# EAGLE design DAPule-KL26Z-v1.0.0 (EAGLE 7.7.0)

## Sheet 1 of 2
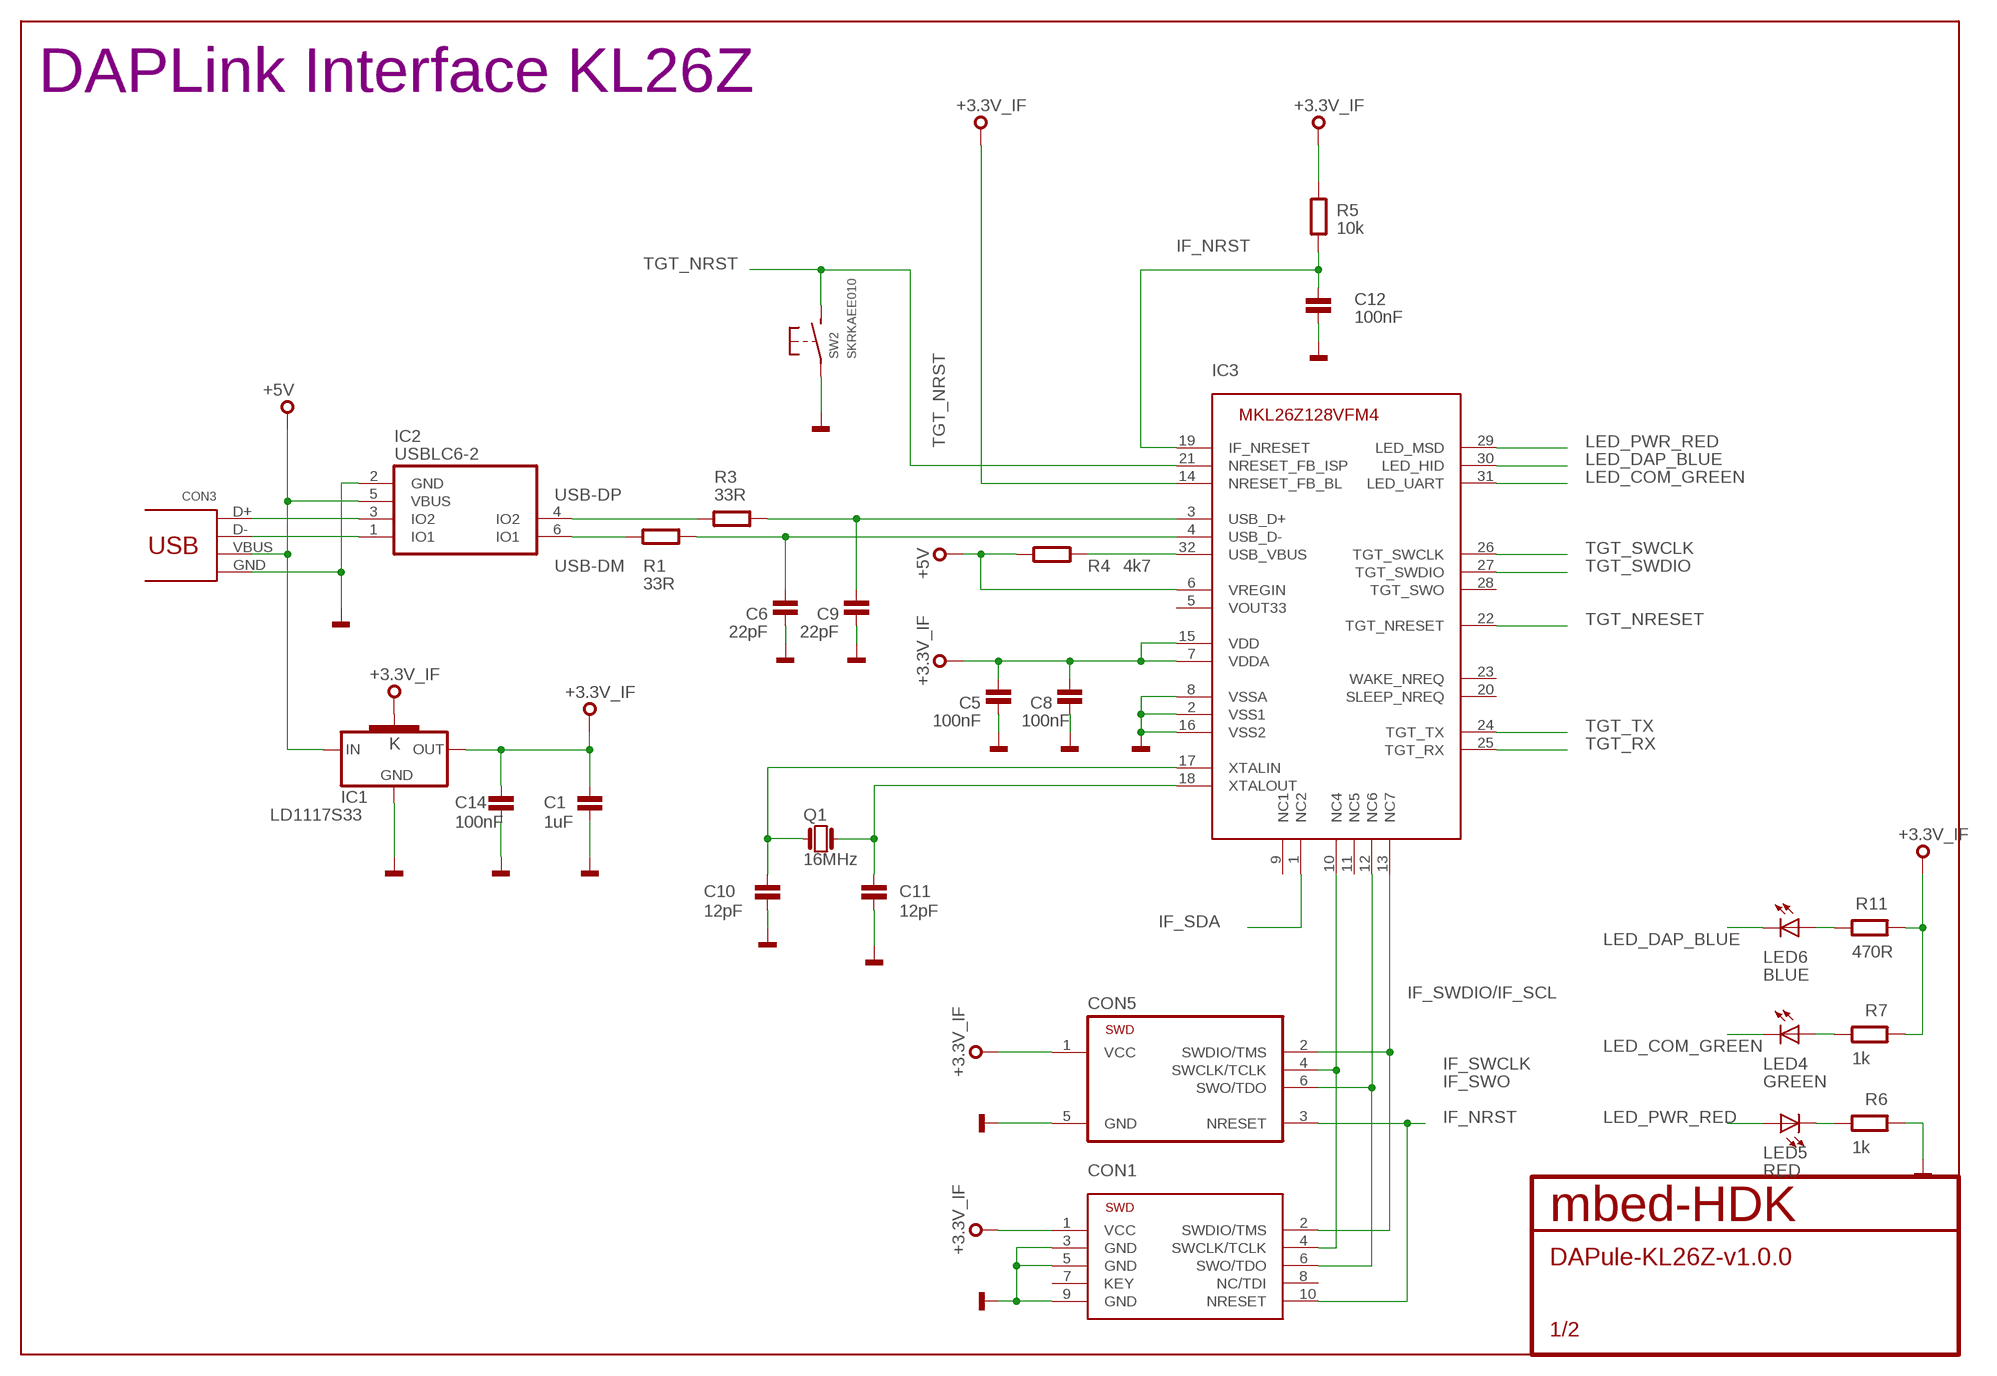
[diagram p0: schematic, sheet 1]

### Parts
C1  1uF  C0603  [0603]
C5  100nF  C0603  [0603]
C6  22pF  C0603  [0603]
C8  100nF  C0603  [0603]
C9  22pF  C0603  [0603]
C10  12pF  C0603  [0603]
C11  12pF  C0603  [0603]
C12  100nF  C0603  [0603]
C14  100nF  C0603  [0603]
CON1  SWD-10-SMD  [SWD-10-SMD]
CON3  USB_MICROB  [MOLEX-47364-0001]
CON5  TC2030-CTX-NL  [TC2030-CTX-NL]
IC1  LD1117S33  [SOT223]
IC2  USBLC6-2SC6  [SOT23-6L]
IC3  IF_MKL26Z128VFM4  [HVQFN32]
LED4  GREEN  LED0603  [CHIPLED_0603]
LED5  RED  LED0603  [CHIPLED_0603]
LED6  BLUE  LED0603  [CHIPLED_0603]
Q1  16MHz  Q_2.5X2.0  [2.5X2.0]
R1  33R  R0603  [0603@1]
R3  33R  R0603  [0603@1]
R4  4k7  R0603  [0603@1]
R5  10k  R0603  [0603@1]
R6  1k  R0603  [0603@1]
R7  1k  R0603  [0603@1]
R11  470R  R0603  [0603@1]
SW2  SKRKAEE010  [SKRKAEE010]

### Nets
+3.3V_IF: C1.1 C5.2 C8.2 C14.1 CON1.1(VCC) CON5.1(VCC) IC1.2(OUT) IC1.4(K) IC3.7(VDDA) IC3.14(NRESET_FB_BL) IC3.15(VDD) R5.2 R7.1 R11.1 ; also sheet 2
+5V: CON3.VBUS IC1.3(IN) IC2.5(VBUS) IC3.6(VREGIN) R4.1
DM: CON3.D- IC2.1(IO1)
DP: CON3.D+ IC2.3(IO2)
GND: C1.2 C5.1 C6.1 C8.1 C9.1 C10.1 C11.1 C12.1 C14.2 CON1.3(GND) CON1.5(GND) CON1.9(GND) CON3.GND CON5.5(GND) IC1.1(GND) IC2.2(GND) IC3.2(VSS1) IC3.8(VSSA) IC3.16(VSS2) R6.1 SW2.P$1(P) ; also sheet 2
IF_NRST: C12.2 CON1.10(NRESET) CON5.3(NRESET) IC3.19(IF_NRESET) R5.1
IF_SDA: IC3.1(NC2) ; also sheet 2
IF_SWCLK: CON1.4(SWCLK/TCLK) CON5.4(SWCLK/TCLK) IC3.10(NC4)
IF_SWDIO/IF_SCL: CON1.2(SWDIO/TMS) CON5.2(SWDIO/TMS) IC3.13(NC7) ; also sheet 2
IF_SWO: CON1.6(SWO/TDO) CON5.6(SWO/TDO) IC3.12(NC6)
LED_COM_GREEN: IC3.31(LED_UART) LED4.C
LED_DAP_BLUE: IC3.30(LED_HID) LED6.C
LED_PWR_RED: IC3.29(LED_MSD) LED5.A
N$2: IC3.32(USB_VBUS) R4.2
N$3: LED6.A R11.2
N$6: LED4.A R7.2
N$7: C6.2 IC3.4(USB_D-) R1.1
N$8: C10.2 IC3.17(XTALIN) Q1.1
N$12: C11.2 IC3.18(XTALOUT) Q1.3
N$16: C9.2 IC3.3(USB_D+) R3.1
N$33: LED5.C R6.2
TGT_NRESET: IC3.22(TGT_NRESET) ; also sheet 2
TGT_NRST: IC3.21(NRESET_FB_ISP) SW2.P$2(S)
TGT_RX: IC3.25(TGT_RX) ; also sheet 2
TGT_SWCLK: IC3.26(TGT_SWCLK) ; also sheet 2
TGT_SWDIO: IC3.27(TGT_SWDIO) ; also sheet 2
TGT_TX: IC3.24(TGT_TX) ; also sheet 2
USB-DM: IC2.6(IO1) R1.2
USB-DP: IC2.4(IO2) R3.2
Unconnected: CON1.7(KEY) CON1.8(NC/TDI) IC3.5(VOUT33) IC3.9(NC1) IC3.11(NC5) IC3.20(SLEEP_NREQ) IC3.23(WAKE_NREQ) IC3.28(TGT_SWO)

### Notes on the sheet
- DAPLink Interface KL26Z

## Sheet 2 of 2
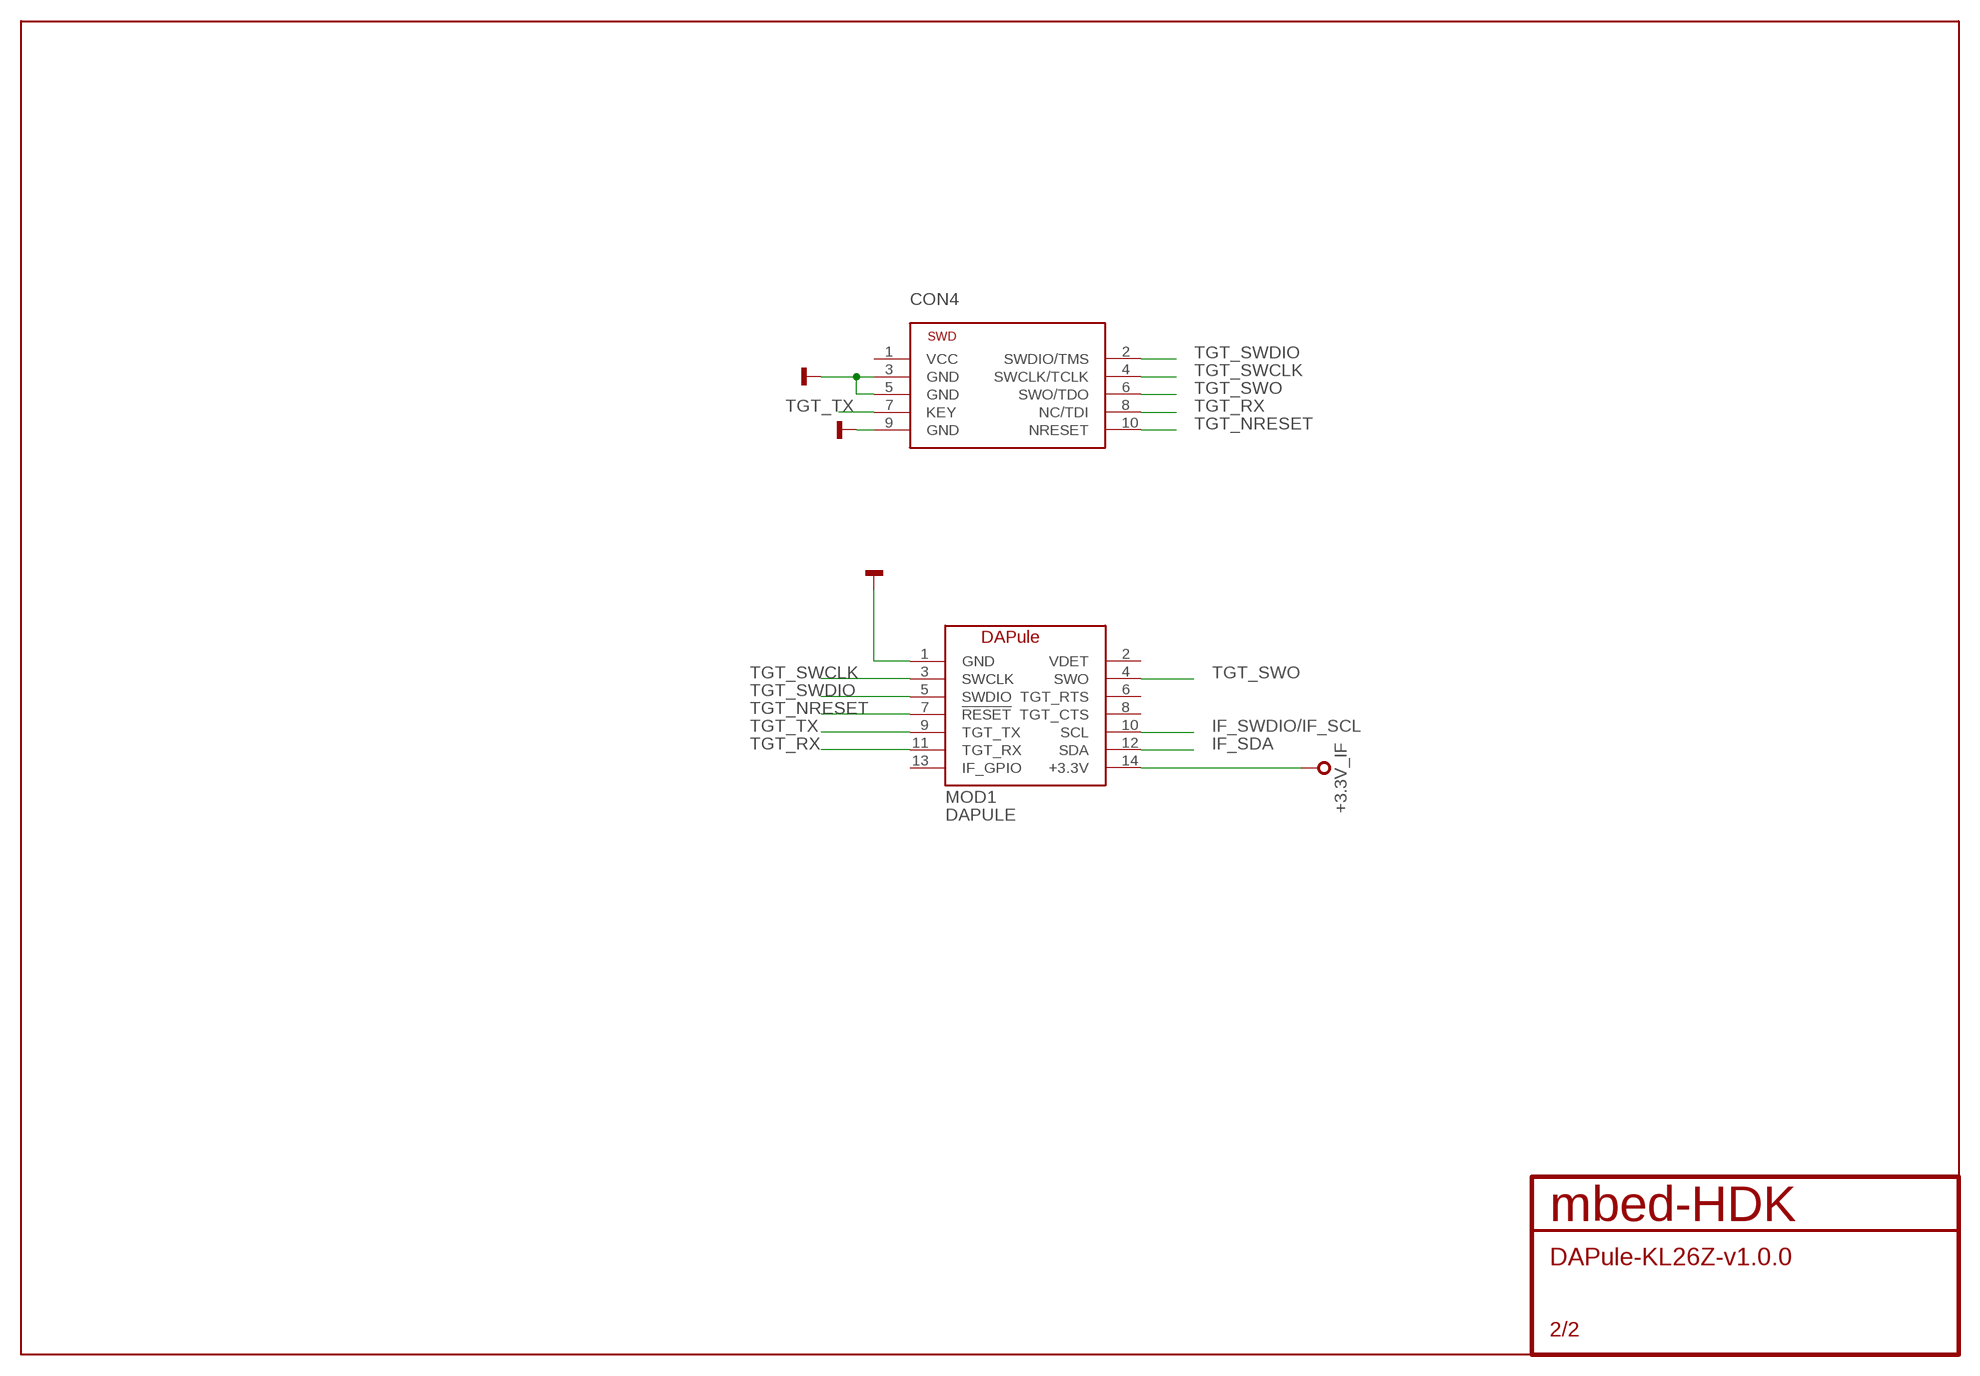
[diagram p1: schematic, sheet 2]

### Parts
CON4  SWD-10-SMD  [SWD-10-SMD]
MOD1  DAPULE  [DAPULE]

### Nets
+3.3V_IF: MOD1.14(+3.3V) ; also sheet 1
GND: CON4.3(GND) CON4.5(GND) CON4.9(GND) MOD1.1(GND) ; also sheet 1
IF_SDA: MOD1.12(SDA) ; also sheet 1
IF_SWDIO/IF_SCL: MOD1.10(SCL) ; also sheet 1
TGT_NRESET: CON4.10(NRESET) MOD1.7(!RESET) ; also sheet 1
TGT_RX: CON4.8(NC/TDI) MOD1.11(TGT_RX) ; also sheet 1
TGT_SWCLK: CON4.4(SWCLK/TCLK) MOD1.3(SWCLK) ; also sheet 1
TGT_SWDIO: CON4.2(SWDIO/TMS) MOD1.5(SWDIO) ; also sheet 1
TGT_SWO: CON4.6(SWO/TDO) MOD1.4(SWO)
TGT_TX: CON4.7(KEY) MOD1.9(TGT_TX) ; also sheet 1
Unconnected: CON4.1(VCC) MOD1.2(VDET) MOD1.6(TGT_RTS) MOD1.8(TGT_CTS) MOD1.13(IF_GPIO)

## Library data of the parts
C1 C5 C6 C8-C12 C14 = mbed-HDK:C: Capacitor
CON1 CON4 = mbed-HDK-Connector:SWD-10: 2.54mm pitch 10-Pin Cortex Programming Header
CON3 = mbed-HDK:USB: USB Connectors
CON5 = mbed-HDK-Connector:TC2030-CTX: Tag-Connect In Circuit Programming & Debug Cable 6 Pin
IC1 = mbed-HDK:LD1117S33: VOLTAGE REGULATOR SMD 3,3V
IC2 = mbed-HDK:USBLC6-2
IC3 = mbed-HDK:IF_MKL26Z128VFM4: CMSIS-DAP Interface (MK20DX128)
LED4-LED6 = mbed-HDK:LED: SMD LED
MOD1 = mbed-HDK-misc-Board:DAPULE
Q1 = mbed-HDK:Q
R1 R3-R7 R11 = mbed-HDK:R
SW2 = mbed-HDK-Switch:SKRKAEE010: MOMENTARY SWITCH PUSH VERTICAL (SPST); MF: ALPS; MFN: SKRKAEE010; OC-MOUSER: 688-SKRKAE

## Board
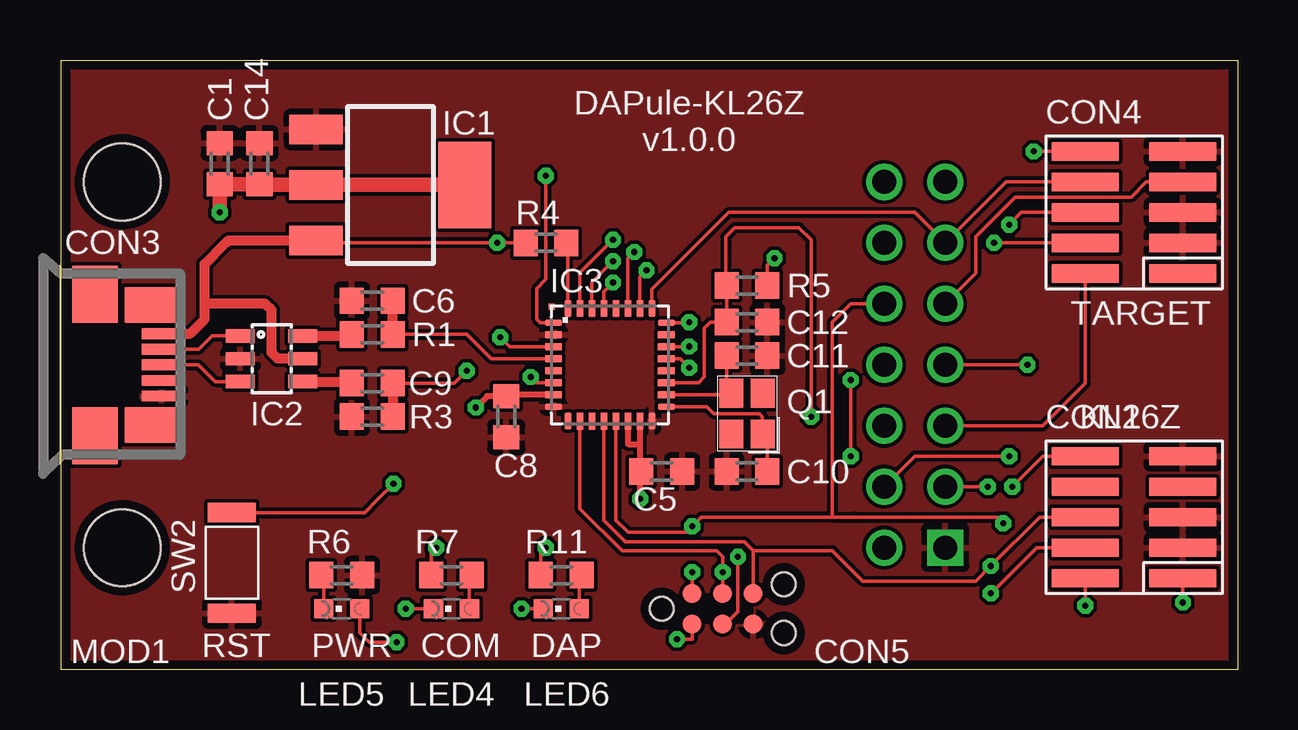
[diagram p2: board, top side]
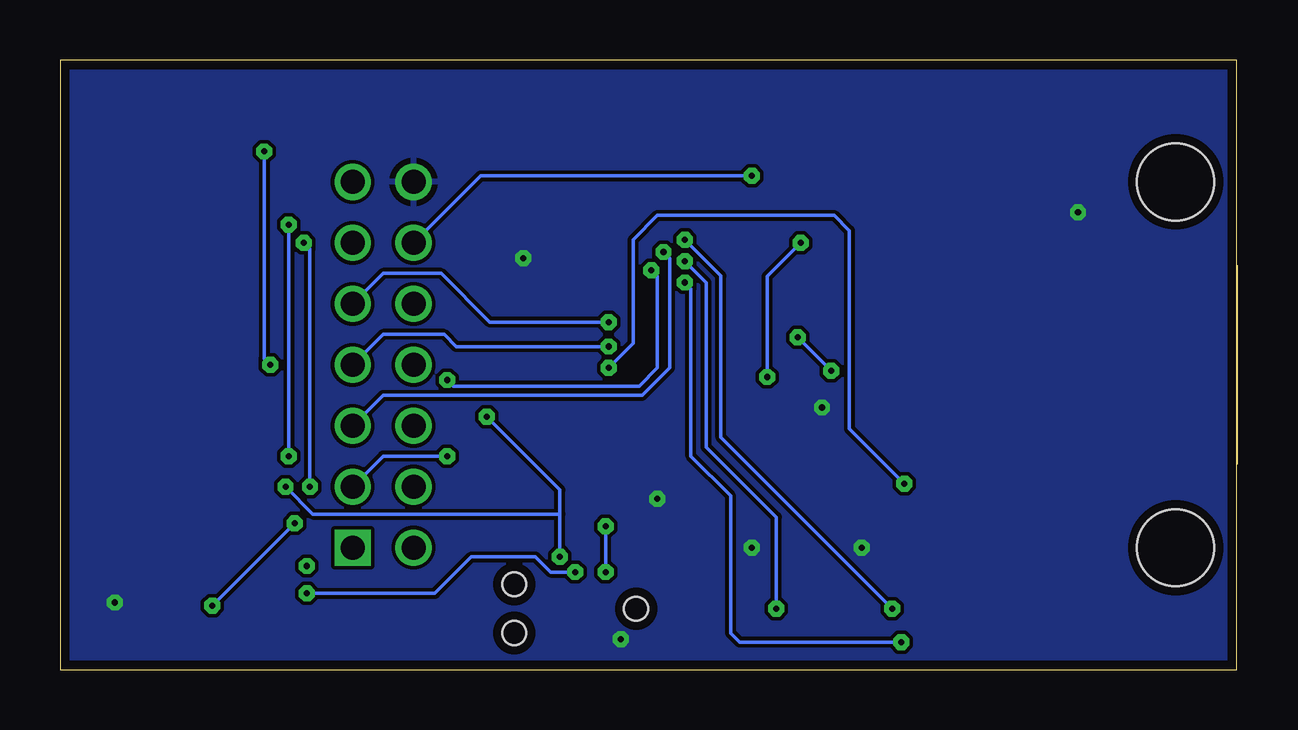
[diagram p3: board, bottom side, seen from below]

Size 49.07 x 25.4 mm. Coordinates in mm from the lower left corner, seen from the top.
Outline: 0.05,7.62 0.05,21.59 0.05,25.4 45.77,25.4 49.07,25.4 49.07,0 45.77,0 0.05,0 0.05,3.81 0.05,7.62
Copper layers ((1*16)): Top 0.035mm / dielectric 0.8mm / Bottom 0.035mm
Design rules "mbed-HDK-6-6-2-layer": minimum track width 6mil, minimum drill 9mil, track to track 6mil, track to pad 6mil, pad to pad 6mil, via to via 6mil, smd to smd 6mil, copper to edge 15mil, drill to drill 8mil, minimum pad ring 10mil, minimum via ring 8mil, stop-mask expansion 4mil, vias tented up to drill 0mil, thermal gap 10mil

### Footprints (pad centres in the part's own frame; a part is rotated, then mirrored left to right if it is on the bottom)
0603 = smd 1 x 1.1: 1 -0.85,0; 2 0.85,0
SWD-10-SMD = smd 0.762 x 2.794: 1 0.381,-2.032; 2 0.381,2.032; 3 1.651,-2.032; 4 1.651,2.032; 5 2.921,-2.032; 6 2.921,2.032; 7 4.191,-2.032; 8 4.191,2.032; 9 5.461,-2.032; 10 5.461,2.032
MOLEX-47364-0001 = smd 1.7 x 0.45: 4 2.8,-0.65; D+ 2.8,0; D- 2.8,0.65; GND 2.8,-1.3; VBUS 2.8,1.3 | smd 1.9 x 2.375: GND1 0,2.95; GND4 0,-2.95 | smd 2.1 x 1.475: GND2 2.3,2.5; GND3 2.3,-2.5
TC2030-CTX-NL = smd 0.787 x 0.787: 1 -1.27,-0.635; 2 -1.27,0.635; 3 0,-0.635; 4 0,0.635; 5 1.27,-0.635; 6 1.27,0.635 | hole 0.991: -2.54,0; 2.54,1.016; 2.54,-1.016
SOT223 = smd 1.219 x 2.235: 1 -2.311,-3.099; 2 0,-3.099; 3 2.311,-3.099 | smd 3.6 x 2.2: 4 0,3.099
SOT23-6L = smd 0.55 x 1.2: 1 -0.95,-1.3; 2 0,-1.3; 3 0.95,-1.3; 4 0.95,1.3; 5 0,1.3; 6 -0.95,1.3
HVQFN32 = smd 0.7 x 0.28: 1 -2.35,1.75; 2 -2.35,1.25; 3 -2.35,0.75; 4 -2.35,0.25; 5 -2.35,-0.25; 6 -2.35,-0.75; 7 -2.35,-1.25; 8 -2.35,-1.75; 17 2.35,-1.75; 18 2.35,-1.25; 19 2.35,-0.75; 20 2.35,-0.25; 21 2.35,0.25; 22 2.35,0.75; 23 2.35,1.25; 24 2.35,1.75 | smd 0.28 x 0.7: 9 -1.75,-2.35; 10 -1.25,-2.35; 11 -0.75,-2.35; 12 -0.25,-2.35; 13 0.25,-2.35; 14 0.75,-2.35; 15 1.25,-2.35; 16 1.75,-2.35; 25 1.75,2.35; 26 1.25,2.35; 27 0.75,2.35; 28 0.25,2.35; 29 -0.25,2.35; 30 -0.75,2.35; 31 -1.25,2.35; 32 -1.75,2.35 | smd 0.25 x 0.25: M1 -2.415,2.415
CHIPLED_0603 = smd 0.8 x 0.8: A 0,-0.75; C 0,0.75
DAPULE = drill 1 square: 1 36.83,-7.62 | drill 1: 2 34.29,-7.62; 3 36.83,-5.08; 4 34.29,-5.08; 5 36.83,-2.54; 6 34.29,-2.54; 7 36.83,0; 8 34.29,0; 9 36.83,2.54; 10 34.29,2.54; 11 36.83,5.08; 12 34.29,5.08; 13 36.83,7.62; 14 34.29,7.62 | hole 3.2: 2.54,7.62; 2.54,-7.62
2.5X2.0 = smd 1.2 x 1: 1 -0.85,-0.65; 2 0.85,-0.65; 3 0.85,0.65; 4 -0.85,0.65
0603@1 = smd 1 x 1.1: 1 -0.85,0; 2 0.85,0
SKRKAEE010 = smd 0.8 x 2: P$1 -2.1,0; P$2 2.1,0

### Placement (x,y rotation side)
C1  6.66,21.08 90 top
C5  25.07,8.25 180 top
C6  13.01,15.37 0 top
C8  18.6,10.54 90 top
C9  13.01,10.54 0 top
C10  28.63,8.25 0 top
C11  28.63,13.08 180 top
C12  28.63,14.48 180 top
C14  8.31,21.08 90 top
CON1  44.76,3.43 90 top
CON3  1.45,12.7 0 top
CON4  44.76,16.13 90 top
CON5  27.61,2.54 0 top
IC1  13.77,20.19 270 top
IC2  8.82,12.95 270 top
IC3  22.91,12.7 0 top
LED4  16.31,2.54 90 top
LED5  11.74,2.54 90 top
LED6  20.88,2.54 90 top
MOD1  0.05,12.7 0 top
Q1  28.63,10.67 90 top
R1  13.01,13.97 180 top
R3  13.01,11.94 180 top
R4  20.25,17.78 0 top
R5  28.63,16 0 top
R6  11.74,3.94 180 top
R7  16.31,3.94 0 top
R11  20.88,3.94 0 top
SW2  7.17,4.44 90 top

### Tracks (layer width: path | path; a pad name or v marks a point on that pad's centre or on a via)
+3.3V_IF  (via drill 0.25)
  Top 0.152: R7.1 15.46,4.86 v15.67,5.08 | R11.1 20.03,4.86 v20.25,5.08 | CON5.1 26.34,1.27 v25.71,1.27 | R5.2 29.48,16.85 v29.77,17.14 | CON1.1 v46.79,2.79
  Top 0.254: IC3.7 18.65,11.45 C8.2 17.79,11.39 v17.32,10.92 | 8.35,20.19 C14.1 | IC3.15 24.16,9.4 | 24.16,8.31 C5.2 24.16,8.31 | IC3.14 23.66,9.41 23.68,9.4 24.16,9.4 | 24.16,8.31 24.16,7.13 v24.18,7.11 | 24.16,9.4 24.16,8.31
  Top 0.61: v6.66,19.05 C1.1 C14.1 | 8.35,20.19 IC1.2 IC1.4
  pour Bottom: 0.05,0 49.07,0 49.07,25.4 0.05,25.4
+5V  (via drill 0.25)
  Top 0.152: R4.1 v18.21,17.78 10.77,17.78 IC1.3 | IC3.6 19.85,11.95 v19.61,12.19
  Top 0.406: CON3.VBUS 5.42,14 6.02,14.6 6.02,15.24 | 6.02,15.24 6.02,16.89 6.91,17.78 7.01,17.88 IC1.3 | IC2.5 9.07,12.95 8.82,13.21 8.82,14.99 8.56,15.24 6.02,15.24
  Bottom 0.152: v19.61,12.19 19.61,16.38 v18.21,17.78
DM
  Top 0.152: CON3.D- 5.78,13.35 6.28,13.84 6.34,13.9 IC2.1
DP
  Top 0.152: CON3.D+ 5.77,12.7 6.4,12.06 6.46,12 IC2.3
GND
  pour Top: 0.05,0 49.07,0 49.07,25.4 0.05,25.4
IF_NRST  (via drill 0.25)
  Top 0.152: IC3.19 26.61,11.95 26.85,12.19 26.85,14.22 27.1,14.48 C12.2 R5.1 27.74,16.04 27.74,18.03 28.12,18.41 30.79,18.41 31.3,17.91 v31.3,10.54 | CON5.3 27.74,1.9 28.25,2.41 28.25,4.32 v28.25,4.7 | CON1.10 40.95,8.89 v39.68,7.62
  Bottom 0.152: v28.25,4.7 28.25,6.48 | 28.25,6.48 28.25,7.49 v31.3,10.54 | v39.68,7.62 38.53,6.48 28.25,6.48
IF_SDA  (via drill 0.25)
  Top 0.152: v20.25,20.57 20.25,16.26 19.87,15.88 19.87,14.6 20.02,14.45 IC3.1
  Bottom 0.152: MOD1.12 31.55,20.57 30.91,20.57 21.14,20.57 v20.25,20.57
IF_SWCLK  (via drill 0.25)
  Top 0.152: IC3.10 21.66,6.71 23.42,4.95 27.36,4.95 27.61,4.7 v27.61,4.06 CON5.4 | CON1.4 40.69,5.08 39.68,4.06 39.17,3.56 39.04,3.43 v38.79,3.17
  Bottom 0.152: v38.79,3.17 33.45,3.17 31.93,4.7 29.26,4.7 28.63,4.06 v27.61,4.06
IF_SWDIO/IF_SCL  (via drill 0.25)
  Top 0.152: IC3.13 23.16,6.23 23.68,5.71 26.09,5.71 v26.34,5.97 26.72,6.35 32.18,6.35 | CON5.2 v26.34,4.06 | MOD1.10 32.95,15.24 32.18,14.48 32.18,6.35 | 32.18,6.35 32.82,6.35 33.07,6.35 39.04,6.35 v39.3,6.1 | v42.72,2.67 CON1.2
  Bottom 0.152: v26.34,4.06 v26.34,5.97 | v39.3,6.1 v42.72,2.67
IF_SWO  (via drill 0.25)
  Top 0.152: IC3.12 22.66,6.22 23.55,5.33 28.5,5.33 28.88,4.95 | 28.88,4.95 CON5.6 | CON1.6 40.82,6.35 v38.79,4.32 38.15,3.68 33.45,3.68 33.2,3.94 32.18,4.95 28.88,4.95
LED_COM_GREEN  (via drill 0.25)
  Top 0.152: IC3.31 21.66,16.53 v23.04,17.91 | LED4.C v14.4,2.54
  Bottom 0.152: v14.4,2.54 14.66,2.79 19.87,8 21.54,9.67 21.54,16.4 v23.04,17.91
LED_DAP_BLUE  (via drill 0.25)
  Top 0.152: IC3.30 22.16,16.14 v23.04,17.02 | LED6.C v19.23,2.54
  Bottom 0.152: v19.23,2.54 19.23,6.35 22.15,9.27 22.15,16.13 v23.04,17.02
LED_PWR_RED  (via drill 0.25)
  Top 0.152: IC3.29 22.66,15.75 v23.04,16.13 | LED5.A 12.49,1.54 12.88,1.14 v14.02,1.14
  Bottom 0.152: v14.02,1.14 20.75,1.14 21.14,1.52 21.14,7.24 22.79,8.89 22.79,15.88 v23.04,16.13
N$2
  Top 0.152: IC3.32 21.16,17.71 R4.2
N$3
  Top 0.152: LED6.A 21.63,3.84 R11.2
N$6
  Top 0.152: LED4.A 17.06,3.84 R7.2
N$7
  Top 0.152: R1.1 16.94,13.97 17.96,12.95 IC3.4
  Top 0.406: R1.1 13.86,15.24 C6.2
N$8
  Top 0.152: IC3.17 26.95,10.95 27.23,10.67 29.14,10.67 29.26,10.54 29.26,9.83 Q1.1 29.48,9.62 C10.2
N$12
  Top 0.152: IC3.18 27.91,11.45 Q1.3 27.78,11.72 C11.2
N$16  (via drill 0.25)
  Top 0.152: IC3.3 18.73,13.45 v18.34,13.84 | v16.94,12.45 16.44,11.94 R3.1
  Top 0.406: R3.1 C9.2
  Bottom 0.152: v18.34,13.84 v16.94,12.45
N$33
  Top 0.152: LED5.C 10.99,3.84 R6.2
TGT_NRESET  (via drill 0.25)
  Top 0.152: IC3.22 v26.2,13.45 v26.21,13.46 | CON4.10 v40.57,21.59 | v40.31,12.7 MOD1.7
  Bottom 0.152: v26.21,13.46 31.17,13.46 32.56,13.46 33.07,13.97 35.61,13.97 MOD1.7 | v40.57,21.59 40.57,12.95 v40.31,12.7
TGT_NRST  (via drill 0.25)
  Top 0.152: IC3.21 25.84,12.95 v26.21,12.57 | v13.9,7.75 13.26,7.11 12.69,6.54 SW2.P$2
  Bottom 0.152: v26.21,12.57 25.83,12.95 25.2,13.59 25.2,17.91 24.18,18.92 16.82,18.92 16.18,18.29 16.18,10.03 v13.9,7.75
TGT_RX
  Top 0.152: IC3.25 24.66,15.85 27.87,19.05 35.61,19.05 MOD1.11 39.42,20.32 CON4.8
TGT_SWCLK  (via drill 0.25)
  Top 0.152: v38.66,7.62 MOD1.3 | IC3.26 24.16,16.36 v24.44,16.64 | v32.95,12.06 v32.95,8.89 | v38.91,17.78 CON4.4
  Bottom 0.152: v24.44,16.64 24.18,16.38 24.18,12.57 24.95,11.81 32.69,11.81 v32.95,12.06 | v32.95,8.89 35.61,8.89 MOD1.3 | v38.66,7.62 38.66,17.53 v38.91,17.78
TGT_SWDIO  (via drill 0.25)
  Top 0.152: IC3.27 23.66,17.13 v23.93,17.4 | MOD1.5 40.95,10.16 42.72,11.94 CON4.2
  Bottom 0.152: MOD1.5 35.61,11.43 24.82,11.43 23.68,12.57 23.68,17.14 v23.93,17.4
TGT_SWO  (via drill 0.25)
  Top 0.152: v39.55,8.89 35.61,8.89 MOD1.4 | CON4.6 40.06,19.05 v39.55,18.54
  Bottom 0.152: v39.55,18.54 v39.55,8.89
TGT_TX  (via drill 0.25)
  Top 0.152: IC3.24 26.19,14.45 v26.21,14.48 | CON4.7 45.27,20.32 44.63,19.68 39.8,19.68 38.15,18.03 38.15,16.51 MOD1.9
  Bottom 0.152: v26.21,14.48 31.17,14.48 33.2,16.51 35.61,16.51 MOD1.9
USB-DM
  Top 0.406: IC2.6 12.09,13.9 R1.2
USB-DP
  Top 0.406: IC2.4 12.09,12 R3.2

### Text on the board
tPlace: DAPule-KL26Z / v1.0.0 | TARGET | KL26Z | RST | PWR | COM | DAP